# EAGLE design MainBoard (EAGLE 7.1.0)
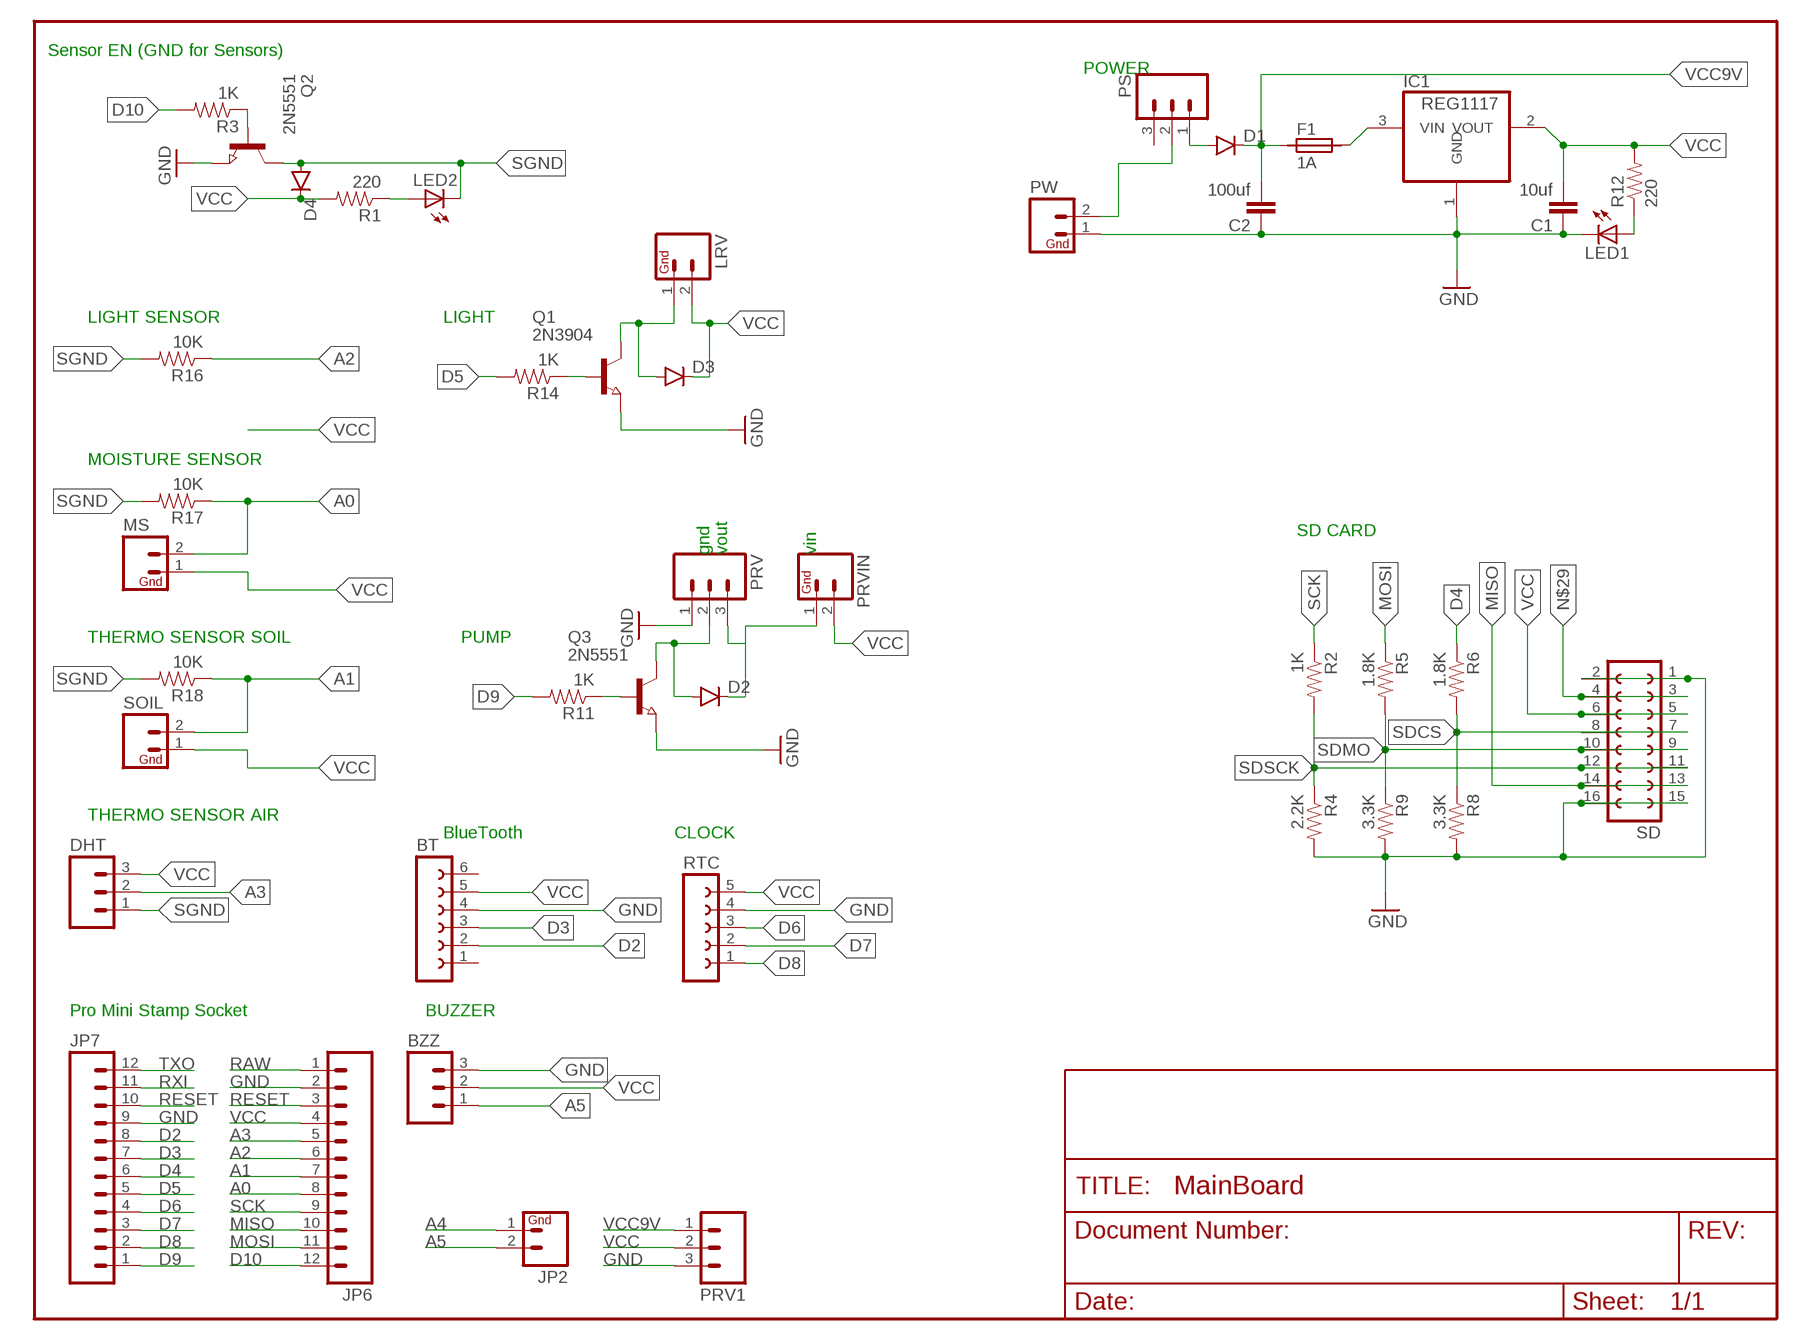
[diagram p0: schematic, sheet 1]

## Parts
BT  FE06-1  [FE06]
BZZ  M03PTH  [1X03]
C1  10uf  CAP0805  [0805]
C2  100uf  CAP0805  [0805]
D1  DIODESMA  [SMA-DIODE]
D2  DIODESMA  [SMA-DIODE]
D3  DIODESMA  [SMA-DIODE]
D4  DIODESMA  [SMA-DIODE]
DHT  M03PTH  [1X03]
F1  1A  SIBA194600  [1820]
IC1  REG1117  [SOT223]
JP2  M02PTH  [1X02]
JP6  M12PTH  [1X12]
JP7  M12PTH  [1X12]
LED1  LEDCHIP-LED0805  [CHIP-LED0805]
LED2  LEDCHIP-LED0805  [CHIP-LED0805]
LRV  M02PTH  [1X02]
MS  M02PTH  [1X02]
PRV  M03PTH  [1X03]
PRV1  M03PTH  [1X03]
PRVIN  M02PTH  [1X02]
PS  M03PTH  [1X03]
PW  M02PTH  [1X02]
Q1  2N3904  NPN-TRANSISTOR_SOT23  [SOT23]
Q2  2N5551  NPN-TRANSISTOR_SOT23  [SOT23]
Q3  2N5551  NPN-TRANSISTOR_SOT23  [SOT23]
R1  220  RESISTOR0805-RES  [0805]
R2  1K  RESISTOR0805-RES  [0805]
R3  1K  RESISTOR0805-RES  [0805]
R4  2.2K  RESISTOR0805-RES  [0805]
R5  1.8K  RESISTOR0805-RES  [0805]
R6  1.8K  RESISTOR0805-RES  [0805]
R8  3.3K  RESISTOR0805-RES  [0805]
R9  3.3K  RESISTOR0805-RES  [0805]
R11  1K  RESISTOR0805-RES  [0805]
R12  220  RESISTOR0805-RES  [0805]
R14  1K  RESISTOR0805-RES  [0805]
R16  10K  RESISTOR0805-RES  [0805]
R17  10K  RESISTOR0805-RES  [0805]
R18  10K  RESISTOR0805-RES  [0805]
RTC  FE05-1  [FE05-1]
SD  FE08-2  [FE08-2]
SOIL  M02PTH  [1X02]

## Nets
A0: JP6.8 MS.2 R17.1
A1: JP6.7 R18.1 SOIL.2
A2: JP6.6 R16.1
A3: DHT.2 JP6.5
A4: JP2.1
A5: BZZ.1 JP2.2
D2: BT.2 JP7.8
D3: BT.3 JP7.7
D4: JP7.6 R6.1
D5: JP7.5 R14.2
D6: JP7.4 RTC.3
D7: JP7.3 RTC.2
D8: JP7.2 RTC.1
D9: JP7.1 R11.2
D10: JP6.12 R3.2
GND: BT.4 BZZ.3 C1.1 C2.1 IC1.1(GND) JP6.2 JP7.9 LED1.C PRV1.3 PRV.1 PW.1 Q1.2(E) Q2.2(E) Q3.2(E) R4.2 R8.2 R9.2 RTC.4 SD.1 SD.2 SD.15 SD.16
MISO: JP6.10 SD.13 SD.14
MOSI: JP6.11 R5.1
N$1: F1.2 IC1.3(VIN)
N$2: PS.2 PW.2
N$3: D2.C PRV.3 PRVIN.1
N$5: D2.A PRV.2 Q3.3(C)
N$6: Q3.1(B) R11.1
N$7: Q2.1(B) R3.1
N$11: LED1.A R12.1
N$13: D1.A PS.1
N$19: D3.A LRV.1 Q1.3(C)
N$20: Q1.1(B) R14.1
N$22: LED2.A R1.1
N$29: SD.3 SD.4
RAW [v]: JP6.1
RESET: JP6.3 JP7.10
RXI: JP7.11
SCK: JP6.9 R2.1
SDCS: R6.2 R8.1 SD.7 SD.8
SDMO: R5.2 R9.1 SD.9 SD.10
SDSCK: R2.2 R4.1 SD.11 SD.12
SGND: D4.A DHT.1 LED2.C Q2.3(C) R16.2 R17.2 R18.2
TXO: JP7.12
VCC: BT.5 BZZ.2 C1.2 D3.C D4.C DHT.3 IC1.2(VOUT) JP6.4 LRV.2 MS.1 PRV1.2 PRVIN.2 R1.2 R12.2 RTC.5 SD.5 SD.6 SOIL.1
VCC9V: C2.2 D1.C F1.1 PRV1.1
Unconnected: BT.1 BT.6 PS.3

## Notes on the sheet
- Sensor EN (GND for Sensors)
- POWER
- LIGHT SENSOR | LIGHT
- MOISTURE SENSOR
- SD CARD
- gnd | vout | vin
- THERMO SENSOR SOIL | PUMP
- THERMO SENSOR AIR
- BlueTooth | CLOCK
- Pro Mini Stamp Socket | BUZZER

## Library data of the parts
BT = con-lsta:FE06-1: FEMALE HEADER; OC_FARNELL: unknown; OC_NEWARK: unknown
BZZ DHT PRV PRV1 PS = SparkFun-Connectors:M03: Header 3 Standard 3-pin 0.1" header. Use with straight break away headers (SKU : PRT-00116), right angle break away headers (PRT-00553), swiss pins (PRT-00743), machine pins (PRT-00117), and female headers (PRT-00115). Molex polarized connector foot print use with SKU : PRT-08232 with associated crimp pins and housings.
C1 C2 = SparkFun-Capacitors:CAP: Capacitor Standard 0603 ceramic capacitor, and 0.1" leaded capacitor.
D1-D4 = SparkFun-DiscreteSemi:DIODE: Diode These are standard reverse protection diodes and small signal diodes. SMA package can handle up to about 1A. SOD-323 can handle about 200mA. What the SOD-323 package when ordering, there are some mfgs out there that are 5-pin packages.
F1 = _hhn_PtcFuses_Siba_r500_Ozan:SIBA194600*: SIBA PTC-Fuses, Series 194600, 1812 (4.5 3.2)mm Source: www.siba.de/ Package: SMD 1812 (4.5 x 3.2)mm Technologies: SIBA194600Axxx xxx: Trip-Current * 10 mA Author: Dipl.-Ing. FH Rainer Bayer
IC1 = burr-brown:REG1117: 800mA and 1A Low Dropout (LDO) Positive Regulator 1.8V, 2.5V, 2.85V, 3.3V, 5V, and Adj; MPN: REG1117; OC_FARNELL: 1097566; OC_NEWARK: 14P6981
JP2 LRV MS PRVIN PW SOIL = SparkFun:M02: Header 2 Standard 2-pin 0.1" header. Use with straight break away headers (SKU : PRT-00116), right angle break away headers (PRT-00553), swiss pins (PRT-00743), machine pins (PRT-00117), and female headers (PRT-00115). Molex polarized connector foot print use with SKU : PRT-08233 with associated crimp pins and housings.
JP6 JP7 = SparkFun:M12: Header 12 Standard 12-pin 0.1" header. Use with straight break away headers (SKU : PRT-00116), right angle break away headers (PRT-00553), swiss pins (PRT-00743), machine pins (PRT-00117), and female headers (PRT-00115).
LED1 LED2 = led:LED: LED OSRAM: - CHIPLED LG R971, LG N971, LY N971, LG Q971, LY Q971, LO R971, LY R971 LH N974, LH R974 LS Q976, LO Q976, LY Q976 LO Q996 - Hyper CHIPLED LW Q18S LB Q993, LB Q99A, LB R99A - SideLED LS A670, LO A670, LY A670, LG A670, LP A670 LB A673, LV A673, LT A673, LW A673 LH A674 LY A675 LS A676, LA A676, LO A676, LY A676, LW A676 LS A679, LY A679, LG A679 - Hyper Micro SIDELED® LS Y876, LA Y876, LO Y876, LY Y876 LT Y87S - SmartLED LW L88C, LW L88S LB L89C, LB L89S, LG L890 LS L89K, LO L89K, LY L89K LS L896, LA L896, LO L896, LY L896 - TOPLED LS T670, LO T670, LY T670, LG T670, LP T670 LSG T670, LSP T670, LSY T670, LOP T670, LYG T670 LG T671, LOG T671, LSG T671 LB T673, LV T673, LT T673, LW T673 LH T674 LS T676, LA T676, LO T676, LY T676, LB T676, LH T676, LSB T676, LW T676 LB T67C, LV T67C, LT T67C, LS T67K, LO T67K, LY T67K, LW E67C LS E67B, LA E67B, LO E67B, LY E67B, LB E67C, LV E67C, LT E67C LW T67C LS T679, LY T679, LG T679 LS T770, LO T770, LY T770, LG T770, LP T770 LB T773, LV T773, LT T773, LW T773 LH T774 LS E675, LA E675, LY E675, LS T675 LS T776, LA T776, LO T776, LY T776, LB T776 LHGB T686 LT T68C, LB T68C - Hyper Mini TOPLED® LB M676 - Mini TOPLED Santana® LG M470 LS M47K, LO M47K, LY M47K Source: http://www.osram.convergy.de LUXEON: - LUMILED® LXK2-PW12-R00, LXK2-PW12-S00, LXK2-PW14-U00, LXK2-PW14-V00 LXK2-PM12-R00, LXK2-PM12-S00, LXK2-PM14-U00 LXK2-PE12-Q00, LXK2-PE12-R00, LXK2-PE12-S00, LXK2-PE14-T00, LXK2-PE14-U00 LXK2-PB12-K00, LXK2-PB12-L00, LXK2-PB12-M00, LXK2-PB14-N00, LXK2-PB14-P00, LXK2-PB14-Q00 LXK2-PR12-L00, LXK2-PR12-M00, LXK2-PR14-Q00, LXK2-PR14-R00 LXK2-PD12-Q00, LXK2-PD12-R00, LXK2-PD12-S00 LXK2-PH12-R00, LXK2-PH12-S00 LXK2-PL12-P00, LXK2-PL12-Q00, LXK2-PL12-R00 Source: www.luxeon.com KINGBRIGHT: KA-3528ASYC Source: www.kingbright.com
Q1-Q3 = semicon-smd-ipc:NPN-TRANSISTOR_: NPN TRANSISTOR
R1-R6 R8 R9 R11 R12 R14 R16-R18 = SparkFun-Passives:RESISTOR: Resistor Basic schematic elements and footprints for 0603, 1206, and PTH resistors.
RTC = con-lsta:FE05-1: FEMALE HEADER; OC_FARNELL: unknown; OC_NEWARK: unknown
SD = con-lsta:FE08-2: FEMALE HEADER; OC_FARNELL: unknown; OC_NEWARK: unknown

## Net classes
0 default: width 0.3 mm, drill 0.5 mm, clearance 0.25 mm

## Board
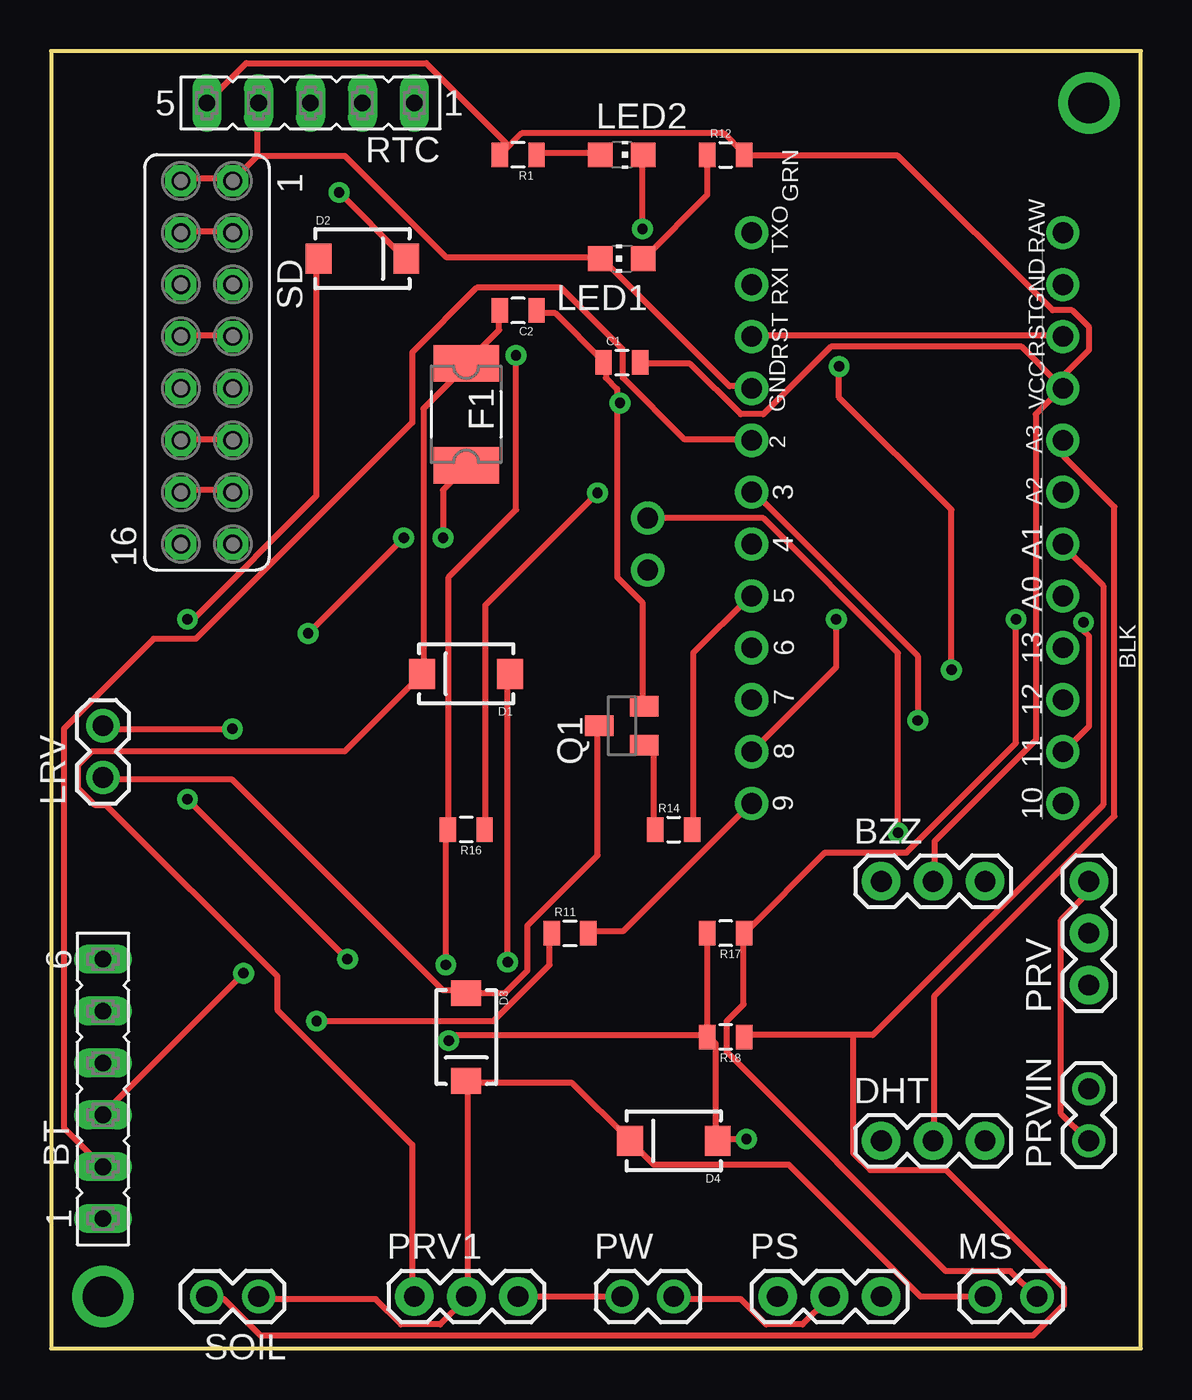
[diagram p1: board, top side]
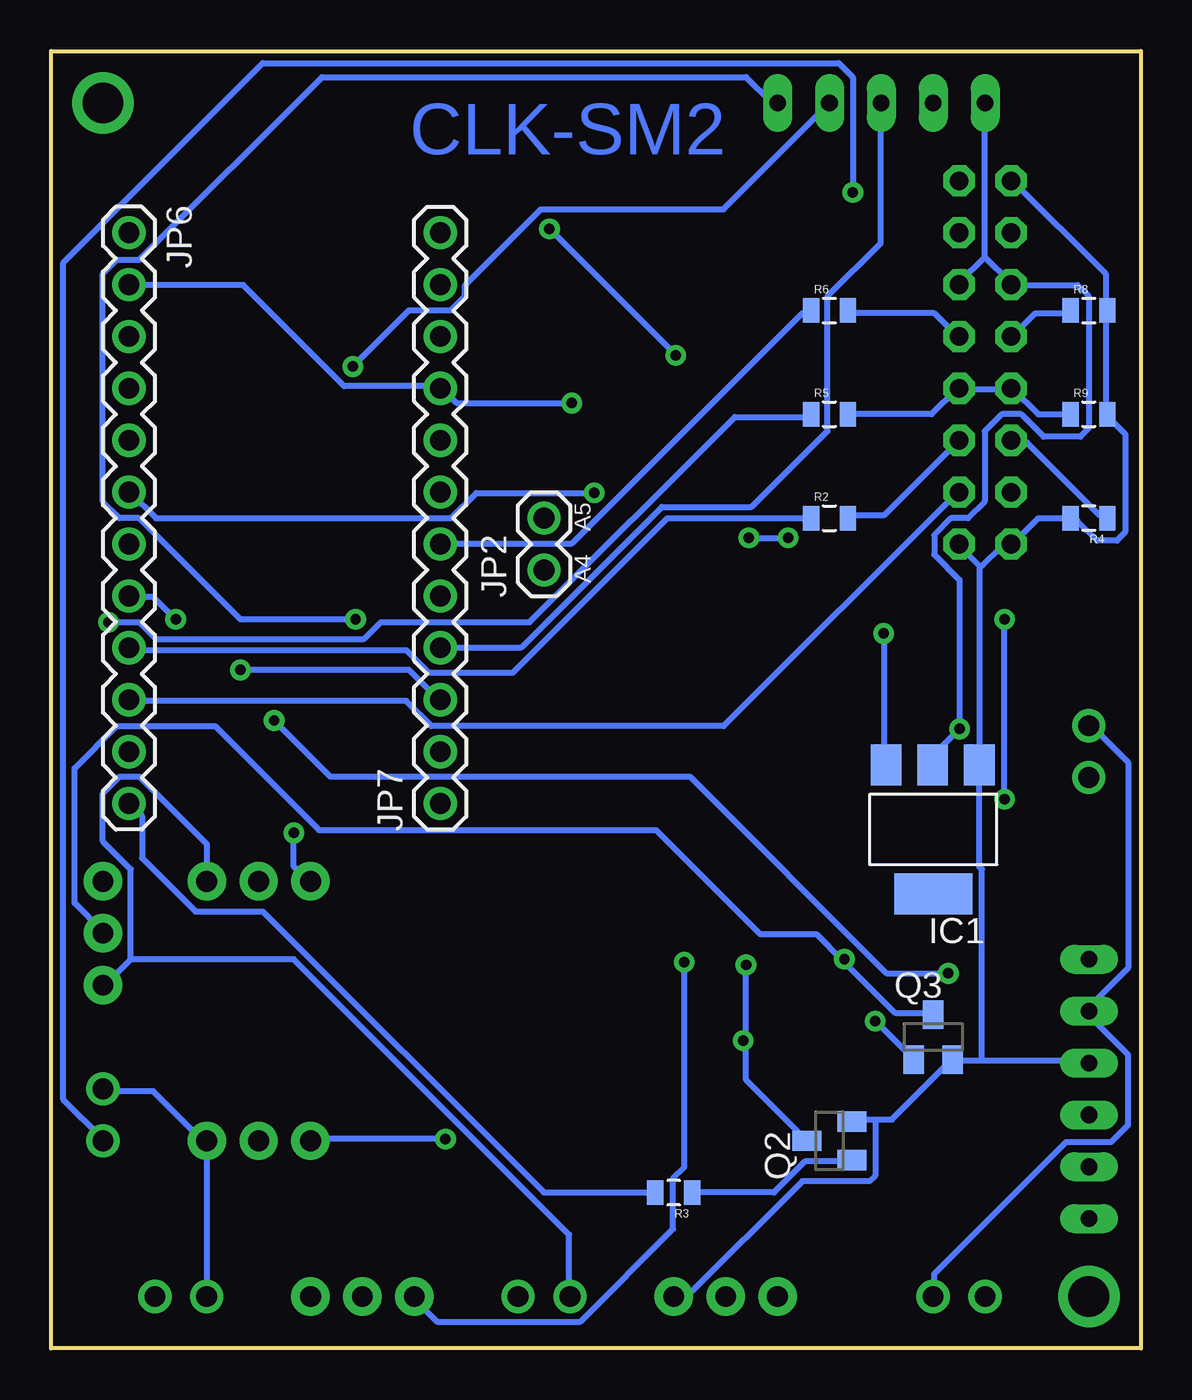
[diagram p2: board, bottom side, seen from below]

Size 53.34 x 63.5 mm. Coordinates in mm from the lower left corner, seen from the top.
Outline: 0,63.5 0,0 53.34,0 53.34,63.5 0,63.5
Copper layers (1*16): Top 0.035mm / dielectric 1.5mm / Bottom 0.035mm
Design rules "SparkFun *": minimum track width 8mil, minimum drill 20mil, track to track 8mil, track to pad 8mil, pad to pad 8mil, via to via 8mil, smd to smd 8mil, copper to edge 10mil, drill to drill 8mil, minimum pad ring 12mil, minimum via ring 10mil, stop-mask expansion 4mil, vias tented up to drill 20mil, thermal gap 10mil

### Footprints (pad centres in the part's own frame; a part is rotated, then mirrored left to right if it is on the bottom)
FE06 = drill 0.813 long: 1 -6.35,0; 2 -3.81,0; 3 -1.27,0; 4 1.27,0; 5 3.81,0; 6 6.35,0
1X03 = drill 1.016 pad 1.88: 1 0,0; 2 2.54,0; 3 5.08,0
0805 = smd 0.8 x 1.2: 1 -0.9,0; 2 0.9,0
SMA-DIODE = smd 1.27 x 1.47: A -2.15,0; C 2.15,0
1820 = smd 1.78 x 3.2: 1 -2.49,0; 2 2.49,0
SOT223 = smd 1.499 x 2.007: 1 -2.261,-3.15; 2 0.025,-3.15; 3 2.311,-3.15 | smd 3.81 x 2.007: 4 0,3.15
1X02 = drill 1.016: 1 0,0; 2 2.54,0
1X12 = drill 1.016: 1 0,0; 2 2.54,0; 3 5.08,0; 4 7.62,0; 5 10.16,0; 6 12.7,0; 7 15.24,0; 8 17.78,0; 9 20.32,0; 10 22.86,0; 11 25.4,0; 12 27.94,0
CHIP-LED0805 = smd 1.2 x 1.2: A 0,-1.05; C 0,1.05
SOT23 = smd 1 x 1.4: 1 -0.95,-1.1; 2 0.95,-1.1; 3 0,1.1
FE05-1 = drill 0.813 long: 1 -5.08,0; 2 -2.54,0; 3 0,0; 4 2.54,0; 5 5.08,0
FE08-2 = drill 0.914 octagon: 1 -8.89,1.27; 2 -8.89,-1.27; 3 -6.35,1.27; 4 -6.35,-1.27; 5 -3.81,1.27; 6 -3.81,-1.27; 7 -1.27,1.27; 8 -1.27,-1.27; 9 1.27,1.27; 10 1.27,-1.27; 11 3.81,1.27; 12 3.81,-1.27; 13 6.35,1.27; 14 6.35,-1.27; 15 8.89,1.27; 16 8.89,-1.27

### Placement (x,y rotation side)
BT  2.54,12.7 90 top
BZZ  40.64,22.86 0 top
C1  27.94,48.26 0 top
C2  22.86,50.8 180 top
D1  20.32,33.02 180 top
D2  15.24,53.34 0 top
D3  20.32,15.24 270 top
D4  30.48,10.16 180 top
DHT  40.64,10.16 0 top
F1  20.32,45.72 270 top
IC1  10.16,25.4 180 bottom
JP2  29.21,38.1 90 bottom
JP6  49.53,54.61 270 bottom
JP7  34.29,26.67 90 bottom
LED1  27.94,53.34 90 top
LED2  27.94,58.42 270 top
LRV  2.54,27.94 90 top
MS  45.72,2.54 0 top
PRV  50.8,17.78 90 top
PRV1  17.78,2.54 0 top
PRVIN  50.8,10.16 90 top
PS  35.56,2.54 0 top
PW  27.94,2.54 0 top
Q1  27.94,30.48 90 top
Q2  15.24,10.16 90 bottom
Q3  10.16,15.24 0 bottom
R1  22.86,58.42 180 top
R2  15.24,40.64 0 bottom
R3  22.86,7.62 180 bottom
R4  2.54,40.64 180 bottom
R5  15.24,45.72 0 bottom
R6  15.24,50.8 0 bottom
R8  2.54,50.8 0 bottom
R9  2.54,45.72 0 bottom
R11  25.4,20.32 0 top
R12  33.02,58.42 0 top
R14  30.48,25.4 0 top
R16  20.32,25.4 180 top
R17  33.02,20.32 180 top
R18  33.02,15.24 180 top
RTC  12.7,60.96 180 top
SD  7.62,48.26 270 top
SOIL  10.16,2.54 180 top

### Tracks (layer width: path | path; a pad name or v marks a point on that pad's centre or on a via)
A0  (via drill 0.51)
  Top 0.3: MS.2 48.2,2.55 46.96,3.79 43.8,3.79 33.07,14.51 33.07,16.02 33.9,16.85 33.9,20.29 R17.1 34.04,20.42 37.88,24.27 41.87,24.27 47.23,29.63 v47.23,35.69
  Bottom 0.3: v47.23,35.69 48.34,36.79 49.44,36.79 JP6.8
A1
  Top 0.3: 39.26,15.34 40.22,15.34 51.5,26.61 51.5,37.34 49.57,39.26 JP6.7 | 39.26,15.34 34.04,15.34 R18.1 | 39.26,15.34 39.26,9.56 40.09,8.73 43.8,8.73 49.57,2.96 49.57,2.13 48.06,0.62 10.25,0.62 8.46,2.41 7.64,2.41 SOIL.2
A2  (via drill 0.51)
  Top 0.3: v26.75,41.87 21.25,36.37 21.25,25.51 R16.1
  Bottom 0.3: v26.75,41.87 32.52,41.87 33.76,40.63 48.2,40.63 49.44,41.87 JP6.6
A3
  Top 0.3: JP6.5 49.57,44.35 49.57,43.66 52.05,41.19 52.05,26.06 43.25,17.26 43.25,10.25 DHT.2
A5  (via drill 0.51)
  Top 0.3: v41.46,25.23 41.46,34.04 34.86,40.63 29.22,40.63 JP2.2
  Bottom 0.3: v41.46,25.23 41.46,23.59 40.77,22.9 BZZ.1
D2
  Top 0.3: BT.2 2.41,9.01 0.62,10.8 0.62,30.32 5.02,34.72 7.08,34.72 17.67,45.31 17.67,48.75 20.84,51.91 24.96,51.91 27.98,48.88 27.98,47.51 31.01,44.48 34.17,44.48 JP7.8
D3  (via drill 0.51)
  Top 0.3: v9.42,18.36 2.55,11.48 BT.3 | v42.42,30.73 42.42,33.9 34.31,42.01 JP7.7
  Bottom 0.3: v9.42,18.36 12.45,18.36 22.07,27.98 39.67,27.98 v42.42,30.73
D4
  Bottom 0.3: R6.1 16.16,50.67 16.57,50.67 27.85,39.4 34.17,39.4 JP7.6
D5
  Top 0.3: R14.2 31.42,25.51 31.42,34.04 34.17,36.79 JP7.5
D6
  Bottom 0.3: RTC.3 12.72,60.85 12.72,54.11 15.34,51.5 15.34,44.9 19.05,41.19 23.45,41.19 30.32,34.31 34.17,34.31 JP7.4
D7  (via drill 0.51)
  Top 0.3: v38.57,48.06 38.57,46.55 44.07,41.05 v44.07,33.21
  Bottom 0.3: v38.57,48.06 35.82,50.81 33.76,50.81 33.07,51.5 33.07,52.05 29.36,55.76 20.42,55.76 15.34,60.85 RTC.2 | v44.07,33.21 35.82,33.21 34.31,31.7 JP7.3
D8  (via drill 0.51)
  Top 0.3: v38.44,35.69 38.44,33.35 34.31,29.22 JP7.2
  Bottom 0.3: v38.44,35.69 44.07,35.69 49.02,40.63 49.98,40.63 50.81,41.46 50.81,52.6 50.12,53.29 49.02,53.29 40.09,62.22 19.32,62.22 18.09,60.98 17.81,60.98 RTC.1
D9
  Top 0.3: R11.2 26.34,20.42 27.98,20.42 34.17,26.61 JP7.1
D10
  Bottom 0.3: R3.2 23.86,7.64 29.22,7.64 42.97,21.39 46.27,21.39 48.88,24 48.88,26.06 49.44,26.61 JP6.12
GND  (via drill 0.51)
  Top 0.3: C2.1 23.86,50.67 24.69,50.67 27.02,48.34 C1.1 27.16,48.2 27.16,47.51 27.71,46.96 27.71,46.27 | 27.71,46.27 27.71,37.75 28.95,36.51 28.95,31.56 Q1.2 | JP7.9 34.17,47.1 33.21,47.1 27.02,53.29 LED1.C 26.89,53.42 19.32,53.42 14.37,58.37 10.11,58.37 | v27.85,46.27 27.71,46.27 | 10.11,58.37 10.11,60.85 RTC.4 | 10.11,58.37 9.01,57.27 SD.1 8.87,57.27 6.4,57.27 SD.2 | PW.1 27.85,2.55 22.9,2.55 PRV1.3
  Bottom 0.3: JP6.2 49.44,52.05 43.94,52.05 38.98,47.1 34.31,47.1 JP7.9 34.17,46.96 33.48,46.27 v27.85,46.27 | 7.91,28.54 IC1.1 | 7.91,38.3 7.91,28.67 IC1.1 | 7.91,38.3 8.87,39.26 SD.15 | 7.91,38.3 7.77,38.3 6.81,39.26 6.4,39.26 SD.16 6.26,39.4 5.02,40.63 3.51,40.63 R4.2 3.37,40.5 3.1,40.5 2.13,39.54 1.17,39.54 0.76,39.95 0.76,44.76 1.58,45.59 R9.2 1.72,45.72 1.72,50.67 R8.2 1.72,50.81 1.72,52.6 6.26,57.13 SD.2 | 49.44,19.05 49.44,23.45 50.81,24.82 50.81,27.16 49.98,27.98 49.02,27.98 45.72,24.69 45.72,22.9 BZZ.3 | 49.44,19.05 50.67,17.81 PRV.1 | 13,11.21 14.1,11.21 Q2.2 | 13,11.21 12.17,11.21 9.29,14.1 Q3.2 9.15,14.1 7.77,14.1 | 7.77,14.1 2.55,14.1 BT.4 | 13,11.21 13,8.46 13.27,8.18 16.57,8.18 22.21,2.55 22.76,2.55 PRV1.3 | 49.44,19.05 41.46,19.05 27.98,5.57 27.98,2.55 PW.1 | 7.77,14.1 7.77,23.45 7.91,23.59 7.91,28.4 IC1.1
MISO
  Top 0.3: SD.14 6.4,42.01 8.87,42.01 SD.13
  Bottom 0.3: JP6.10 49.44,31.7 35.96,31.7 34.72,30.46 20.42,30.46 9.01,41.87 SD.13
MOSI  (via drill 0.51)
  Top 0.3: v50.54,35.55 50.54,35.13 50.81,34.86 50.81,30.46 49.57,29.22 JP6.11
  Bottom 0.3: v50.54,35.55 49.02,35.55 48.2,34.72 38.02,34.72 37.2,35.55 29.91,35.55 19.87,45.59 16.16,45.59 R5.1
N$1  (via drill 0.51)
  Top 0.3: v17.26,39.67 v12.59,35 | v19.19,39.67 19.19,42.01 20.29,43.11 F1.2
  Bottom 0.3: v12.59,35 12.59,28.67 IC1.3 | v19.19,39.67 v17.26,39.67
N$2
  Top 0.3: PW.2 30.6,2.41 33.76,2.41 35,1.17 36.79,1.17 38.02,2.41 PS.2
N$3  (via drill 0.51)
  Top 0.3: v14.1,56.59 17.26,53.42 D2.C | PRV.3 50.67,22.76 50.67,22.21 49.44,20.97 49.44,11.48 50.67,10.25 PRVIN.1
  Bottom 0.3: v14.1,56.59 14.1,62.22 14.79,62.91 42.97,62.91 52.73,53.15 52.73,12.17 50.81,10.25 PRVIN.1
N$4  (via drill 2)
  other vias: 2.54,2.54
N$5  (via drill 0.51)
  Top 0.3: v6.67,35.69 6.95,35.69 13,41.73 13,53.29 D2.A | v14.51,19.05 v6.67,26.89
  Bottom 0.3: 14.58,18.98 15.89,20.29 18.64,20.29 23.72,25.37 40.22,25.37 45.31,30.46 50.12,30.46 52.19,28.4 52.19,21.8 50.81,20.42 PRV.2 | 14.58,18.98 12.04,16.44 10.25,16.44 Q3.3 | v6.67,26.89 v6.67,35.69 | v14.51,19.05 14.58,18.98
N$6  (via drill 0.51)
  Top 0.3: v13,16.02 21.66,16.02 24.41,18.77 24.41,20.29 R11.1
  Bottom 0.3: v13,16.02 11.21,14.23 Q3.1
N$7
  Bottom 0.3: R3.1 21.94,7.64 17.95,7.64 16.44,9.15 14.23,9.15 Q2.1
N$9  (via drill 2)
  other vias: 50.8,60.96
N$11
  Top 0.3: LED1.A 29.09,53.42 32.11,56.45 32.11,58.37 R12.1
N$13  (via drill 0.51)
  Top 0.3: v22.35,18.91 22.35,32.94 D1.A
  Bottom 0.3: v22.35,18.91 22.35,8.87 22.9,8.32 22.9,5.85 27.44,1.31 34.45,1.31 35.55,2.41 PS.1
N$19
  Top 0.3: Q1.3 26.75,30.46 26.75,24.14 23.31,20.7 23.31,18.5 22.21,17.4 20.42,17.4 D3.A 20.29,17.54 19.19,17.54 8.87,27.85 2.55,27.85 LRV.1
N$20
  Top 0.3: R14.1 29.5,25.51 29.5,29.09 29.09,29.5 Q1.1
N$22
  Top 0.3: R1.1 23.86,58.51 26.89,58.51 LED2.A
N$29
  Top 0.3: SD.4 6.4,54.66 8.87,54.66 SD.3
RESET
  Top 0.3: JP7.10 34.31,49.57 49.44,49.57 JP6.3
SCK
  Bottom 0.3: R2.1 16.16,40.63 23.17,40.63 30.73,33.07 34.86,33.07 35.96,34.17 49.44,34.17 JP6.9
SDCS
  Top 0.3: SD.8 6.4,49.57 8.87,49.57 SD.7
  Bottom 0.3: R8.1 3.51,50.67 5.16,50.67 6.26,49.57 SD.8 | R6.2 14.23,50.67 10.11,50.67 9.01,49.57 SD.7
SDMO
  Bottom 0.3: R9.1 3.51,45.72 5.02,45.72 6.26,46.96 SD.10 6.4,46.96 8.73,46.96 SD.9 9.01,46.96 10.25,45.72 14.23,45.72 R5.2
SDSCK
  Top 0.3: SD.12 6.4,44.48 8.87,44.48 SD.11
  Bottom 0.3: R4.1 1.72,40.77 2,40.77 5.57,44.35 6.26,44.35 SD.12 | R2.2 14.23,40.77 12.59,40.77 9.01,44.35 SD.11
SGND  (via drill 0.51)
  Top 0.3: R18.2 32.11,15.34 32.11,20.29 R17.2 | R18.2 32.25,15.2 32.52,14.92 32.52,10.25 D4.A 32.66,10.25 v34.04,10.25 | v19.32,18.77 19.32,25.37 R16.2 19.46,25.51 19.46,37.75 22.76,41.05 v22.76,48.61 | v28.95,54.8 28.95,58.37 LED2.C | v19.46,15.06 19.73,15.34 31.97,15.34 R18.2
  Bottom 0.3: v34.04,10.25 40.63,10.25 DHT.1 | 19.32,15.06 19.32,13.14 16.44,10.25 Q2.3 | 19.32,15.06 v19.32,18.77 | v22.76,48.61 v28.95,54.8 | v19.46,15.06 19.32,15.06
VCC  (via drill 0.51)
  Top 0.3: v8.87,30.32 2.68,30.32 2.55,30.46 LRV.2 | SOIL.1 10.25,2.41 15.89,2.41 17.12,1.17 19.05,1.17 20.29,2.41 PRV1.2 20.42,2.55 20.42,12.86 D3.C 20.42,13 25.51,13 28.26,10.25 D4.C 28.4,10.11 29.5,9.01 36.1,9.01 42.56,2.55 45.59,2.55 MS.1 | RTC.5 7.64,60.98 9.56,62.91 18.36,62.91 22.35,58.92 R1.2 22.07,58.51 23.04,59.47 32.94,59.47 33.9,58.51 R12.2 34.04,58.37 41.46,58.37 49.02,50.81 49.98,50.81 50.81,49.98 50.81,48.88 49.3,47.37 JP6.4 | C1.2 28.95,48.2 31.29,48.2 33.76,45.72 34.86,45.72 38.16,49.02 47.51,49.02 49.44,47.1 JP6.4 | BZZ.2 43.25,22.9 43.25,24.82 48.2,29.77 48.2,45.72 49.44,46.96 JP6.4
  Bottom 0.3: IC1.2 10.11,28.67 10.11,29.09 v8.87,30.32 8.87,37.61 10.11,38.85 10.11,39.81 9.29,40.63 8.46,40.63 7.64,41.46 7.64,44.9 6.81,45.72 5.85,45.72 4.75,44.62 2.96,44.62 2.55,45.04 2.55,51.5 3.1,52.05 6.26,52.05 SD.6 6.4,52.19 7.64,53.42 | LRV.2 2.41,30.46 0.62,28.67 0.62,18.64 2.41,16.85 2.41,16.57 BT.5 2.41,16.44 2.41,16.16 0.62,14.37 0.62,10.93 1.45,10.11 3.65,10.11 10.11,3.65 10.11,2.55 SOIL.1 | MS.1 45.72,10.11 DHT.3 45.86,10.11 48.34,12.59 50.67,12.59 PRVIN.2 | 7.64,53.42 7.64,60.85 RTC.5 | 7.64,53.42 8.87,52.19 SD.5
VCC9V
  Top 0.3: C2.2 21.94,50.67 21.94,49.85 20.42,48.34 F1.1 20.29,48.06 18.22,46 18.22,33.07 D1.C 14.37,29.22 2,29.22 1.31,28.54 1.31,27.44 2.13,26.61 2.68,26.61 11.07,18.22 11.07,16.57 17.67,9.97 17.67,2.55 PRV1.1

### Text on the board
Bottom: CLK-SM2
tPlace: GRN | TXO | RAW | RXI | GND | RST | RST | VCC | GND | 2 | A3 | 3 | A2 | 4 | A1 | 5 | A0 | 6 | 13 | BLK | 7 | 12 | 8 | 11 | 9 | 10
bPlace: A5 | A4